# EAGLE design oled_adapter (EAGLE 6.5.0)
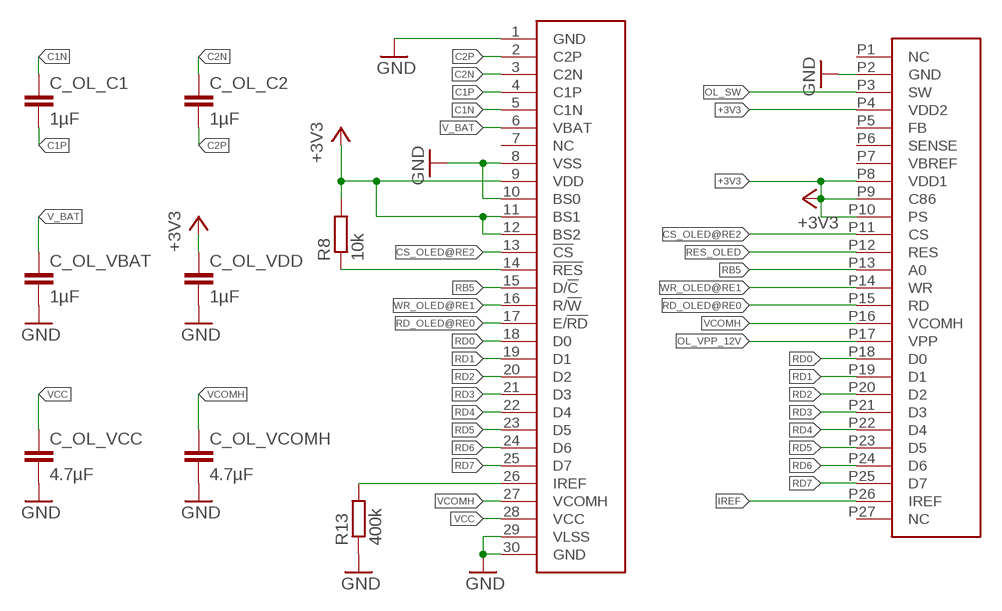
[diagram p0: schematic, sheet 1]

## Parts
C_OL_C1  1µF  C-EUC0603K  [C0603K]
C_OL_C2  1µF  C-EUC0603K  [C0603K]
C_OL_VBAT  1µF  C-EUC0603K  [C0603K]
C_OL_VCC  4.7µF  C-EUC0603K  [C0603K]
C_OL_VCOMH  4.7µF  C-EUC0603K  [C0603K]
C_OL_VDD  1µF  C-EUC0603K  [C0603K]
CON_OLED  OLED_DENSITRON  [CON_DD-12864WE-1A]
OLED  DD-12864WE-4A  [CON_DD-12864WE-4A]
R8  10k  R-EU_R0603  [R0603]
R13  400k  R-EU_R0603  [R0603]

## Nets
+3V3: C_OL_VDD.1 CON_OLED.P4(VDD2) CON_OLED.P8(VDD1) CON_OLED.P9(C86) CON_OLED.P10(PS) OLED.9(VDD) OLED.11(BS1) OLED.12(BS2) R8.2
C1N: C_OL_C1.1 OLED.5(C1N)
C1P: C_OL_C1.2 OLED.4(C1P)
C2N: C_OL_C2.1 OLED.3(C2N)
C2P: C_OL_C2.2 OLED.2(C2P)
CS_OLED@RE2: CON_OLED.P11(CS) OLED.13(!CS)
GND: C_OL_VBAT.2 C_OL_VCC.2 C_OL_VCOMH.2 C_OL_VDD.2 CON_OLED.P2(GND) OLED.1(GND) OLED.8(VSS) OLED.10(BS0) OLED.29(VLSS) OLED.30(GND) R13.1
IREF: CON_OLED.P26(IREF) OLED.26(IREF) R13.2
OL_SW: CON_OLED.P3(SW)
OL_VPP_12V: CON_OLED.P17(VPP)
RB5: CON_OLED.P13(A0) OLED.15(D/!C)
RD0: CON_OLED.P18(D0) OLED.18(D0)
RD1: CON_OLED.P19(D1) OLED.19(D1)
RD2: CON_OLED.P20(D2) OLED.20(D2)
RD3: CON_OLED.P21(D3) OLED.21(D3)
RD4: CON_OLED.P22(D4) OLED.22(D4)
RD5: CON_OLED.P23(D5) OLED.23(D5)
RD6: CON_OLED.P24(D6) OLED.24(D6)
RD7: CON_OLED.P25(D7) OLED.25(D7)
RD_OLED@RE0: CON_OLED.P15(RD) OLED.17(E/!RD)
RES_OLED: CON_OLED.P12(RES) OLED.14(!RES) R8.1
V_BAT: C_OL_VBAT.1 OLED.6(VBAT)
VCC: C_OL_VCC.1 OLED.28(VCC)
VCOMH: C_OL_VCOMH.1 CON_OLED.P16(VCOMH) OLED.27(VCOMH)
WR_OLED@RE1: CON_OLED.P14(WR) OLED.16(R/!W)
Unconnected: CON_OLED.P1(NC) CON_OLED.P5(FB) CON_OLED.P6(SENSE) CON_OLED.P7(VBREF) CON_OLED.P27(NC) OLED.7(NC)

## Library data of the parts
C_OL_C1 C_OL_C2 C_OL_VBAT C_OL_VCC C_OL_VCOMH C_OL_VDD = rcl:C-EU: CAPACITOR, European symbol
CON_OLED = HedgehogLib:OLED_DENSITRON
OLED = HedgehogLib:DD-12864WE-4A
R8 R13 = rcl:R-EU_: RESISTOR, European symbol

## Board
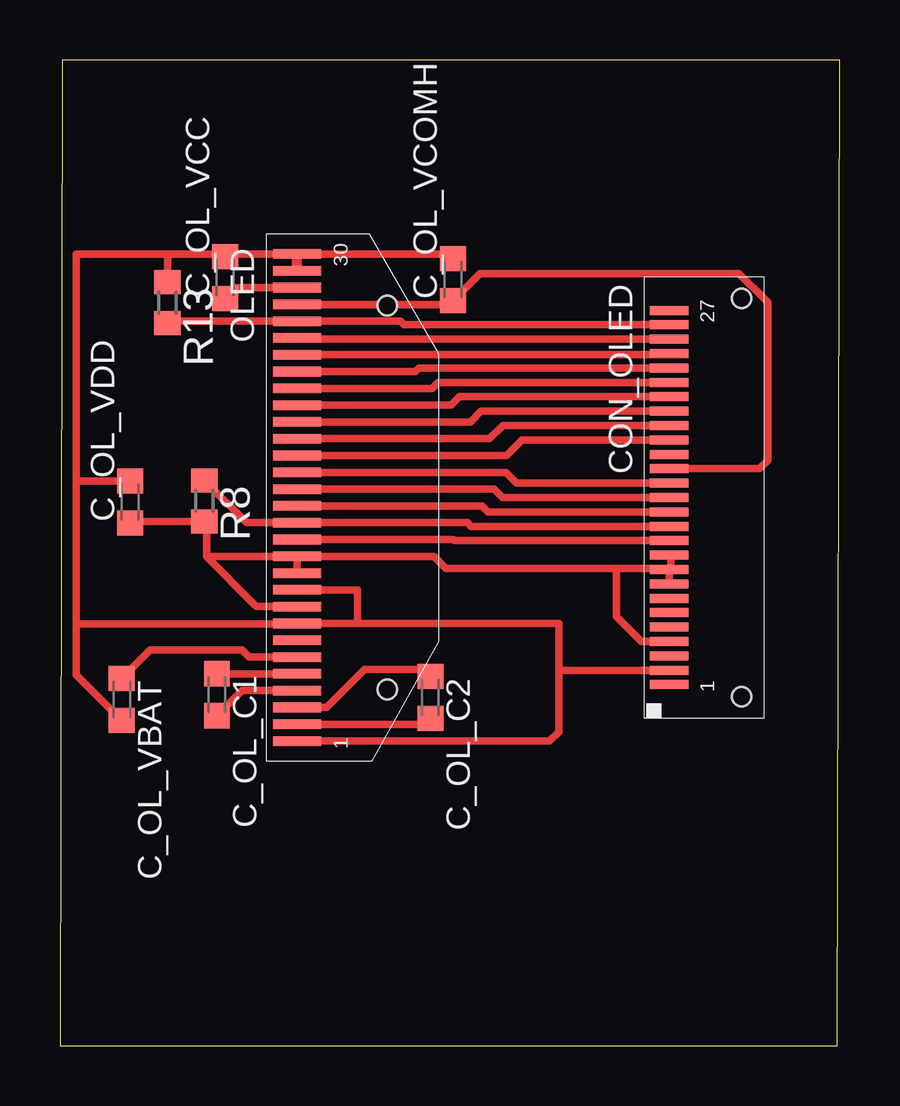
[diagram p1: board, top side]

Size 32.5 x 41.1 mm. Coordinates in mm from the lower left corner, seen from the top.
Outline: 0,0 32.4,0 32.5,41.1 0.1,41.1 0,0
Copper layers (1*16): Top 0.035mm / dielectric 1.5mm / Bottom 0.035mm
Design rules "default": minimum track width 10mil, minimum drill 24mil, track to track 8mil, track to pad 8mil, pad to pad 8mil, via to via 8mil, smd to smd 8mil, copper to edge 40mil, drill to drill 8mil, minimum pad ring 10mil, minimum via ring 8mil, stop-mask expansion 4mil, vias tented up to drill 0mil, thermal gap 10mil

### Footprints (pad centres in the part's own frame; a part is rotated, then mirrored left to right if it is on the bottom)
C0603K = smd 1.05 x 1.08: 1 -0.875,0; 2 0.875,0
CON_DD-12864WE-1A = smd 0.375 x 1.6: P1 7.8,0; P2 7.2,0; P3 6.6,0; P4 6,0; P5 5.4,0; P6 4.8,0; P7 4.2,0; P8 3.6,0; P9 3,0; P10 2.4,0; P11 1.8,0; P12 1.2,0; P13 0.6,0; P14 0,0; P15 -0.6,0; P16 -1.2,0; P17 -1.8,0; P18 -2.4,0; P19 -3,0; P20 -3.6,0; P21 -4.2,0; P22 -4.8,0; P23 -5.4,0; P24 -6,0; P25 -6.6,0; P26 -7.2,0; P27 -7.8,0 | hole 0.8: -8.3,3.025; 8.3,3.025
CON_DD-12864WE-4A = smd 0.4 x 2: 1 10.15,1; 2 9.45,1; 3 8.75,1; 4 8.05,1; 5 7.35,1; 6 6.65,1; 7 5.95,1; 8 5.25,1; 9 4.55,1; 10 3.85,1; 11 3.15,1; 12 2.45,1; 13 1.75,1; 14 1.05,1; 15 0.35,1; 16 -0.35,1; 17 -1.05,1; 18 -1.75,1; 19 -2.45,1; 20 -3.15,1; 21 -3.85,1; 22 -4.55,1; 23 -5.25,1; 24 -5.95,1; 25 -6.65,1; 26 -7.35,1; 27 -8.05,1; 28 -8.75,1; 29 -9.45,1; 30 -10.15,1 | hole 0.8: -8,4.75; 8,4.75
R0603 = smd 1 x 1.1: 1 -0.85,0; 2 0.85,0

### Placement (x,y rotation side)
C_OL_C1  6.54,14.64 270 top
C_OL_C2  15.44,14.53 270 top
C_OL_VBAT  2.58,14.44 270 top
C_OL_VCC  6.89,32.03 90 top
C_OL_VCOMH  16.38,31.95 90 top
C_OL_VDD  2.93,22.67 90 top
CON_OLED  25.4,22.86 270 top
OLED  8.89,22.86 270 top
R8  6.02,22.72 270 top
R13  4.48,30.99 270 top

### Tracks (layer width: path | path; a pad name or v marks a point on that pad's centre or on a via)
+3V3
  Top 0.305: OLED.12 15.59,20.41 16.1,19.9 23.2,19.9 | 23.2,19.9 25.46,19.9 | 25.46,19.9 CON_OLED.P9 CON_OLED.P8 | OLED.11 OLED.12 | OLED.9 8.19,18.31 8.1,18.4 6.11,20.41 | 6.11,20.41 OLED.12 | 25.46,19.9 25.46,20.42 CON_OLED.P10 | CON_OLED.P4 24.24,16.86 23.2,17.9 23.2,19.9 | 6.11,20.41 6.11,21.78 R8.2 3,21.87 C_OL_VDD.1
C1N
  Top 0.305: OLED.5 7.25,15.51 C_OL_C1.1
C1P
  Top 0.305: OLED.4 7.58,14.81 C_OL_C1.2
C2N
  Top 0.305: OLED.3 11.11,14.11 12.7,15.7 15.14,15.7 C_OL_C2.1
C2P
  Top 0.305: OLED.2 15.2,13.41 C_OL_C2.2
CS_OLED@RE2
  Top 0.305: OLED.13 16.39,21.11 16.44,21.06 CON_OLED.P11
GND
  Top 0.305: 6.9,33.01 OLED.30 16.2,33.01 arc-90 C_OL_VCOMH.2 | 6.9,33.01 4.5,33.01 | 4.5,33.01 0.68,33.01 0.68,23.6 | 0.68,23.6 0.68,17.6 | OLED.10 12.4,19.01 12.4,17.61 | 0.68,17.6 OLED.8 12.4,17.61 | CON_OLED.P2 20.8,15.66 | 20.8,15.66 20.8,13.1 20.41,12.71 OLED.1 | 12.4,17.61 20.8,17.61 20.8,15.66 | C_OL_VDD.2 0.73,23.55 0.68,23.6 | R13.1 4.48,32.99 4.5,33.01 | C_OL_VCC.2 6.89,33 6.9,33.01 | 0.68,17.6 0.68,15.46 C_OL_VBAT.2
  Top 0.406: OLED.29 OLED.30
IREF
  Top 0.305: CON_OLED.P26 14.34,30.06 14.19,30.21 OLED.26 4.55,30.21 R13.2
RB5
  Top 0.305: OLED.15 17.59,22.51 17.84,22.26 CON_OLED.P13
RD0
  Top 0.305: OLED.18 18.61,24.61 19.26,25.26 CON_OLED.P18
RD1
  Top 0.305: OLED.19 17.91,25.31 18.46,25.86 CON_OLED.P19
RD2
  Top 0.305: OLED.20 17.11,26.01 17.56,26.46 CON_OLED.P20
RD3
  Top 0.305: OLED.21 16.31,26.71 16.66,27.06 CON_OLED.P21
RD4
  Top 0.305: OLED.22 15.51,27.41 15.76,27.66 CON_OLED.P22
RD5
  Top 0.305: OLED.23 14.81,28.11 14.96,28.26 CON_OLED.P23
RD6
  Top 0.305: OLED.24 25.35,28.81 CON_OLED.P24
RD7
  Top 0.305: OLED.25 9.94,29.46 CON_OLED.P25
RD_OLED@RE0
  Top 0.305: OLED.17 18.59,23.91 19.04,23.46 CON_OLED.P15
RES_OLED
  Top 0.305: CON_OLED.P12 17.14,21.66 16.99,21.81 OLED.14 7.78,21.81 R8.1
V_BAT
  Top 0.305: OLED.6 7.89,16.21 7.6,16.5 3.77,16.5 C_OL_VBAT.1
VCC
  Top 0.305: C_OL_VCC.1 7.34,31.61 OLED.28
VCOMH
  Top 0.305: OLED.27 16.21,30.91 C_OL_VCOMH.1 17.5,32.2 28.3,32.2 29.5,31 29.5,24.4 29.16,24.06 CON_OLED.P16
WR_OLED@RE1
  Top 0.305: OLED.16 18.09,23.21 18.44,22.86 CON_OLED.P14